# Altium schematic sheet Extension_connectors.SchDoc: Extension_connectors
size A4; Date: Not used; ApprovedBy: Not used; CheckedBy: Not used; Author: Not used; CompanyName: STMicroelectronics; DrawnBy: Not used; Engineer: Not used; Organization: Not used; Address1: Not used; Address2: Not used; Address3: Not used; Address4: Not used; DocumentNumber: Not used; Revision: Not used; SheetNumber: 8; SheetTotal: 12; CurrentTime: Not used; CurrentDate: Not used; Time: Not used; DocumentFullPathAndName: Not used; DocumentName: Not used; ModifiedDate: Not used; ImagePath: Not used; ProjectName: Not used; Application_BuildNumber: Not used
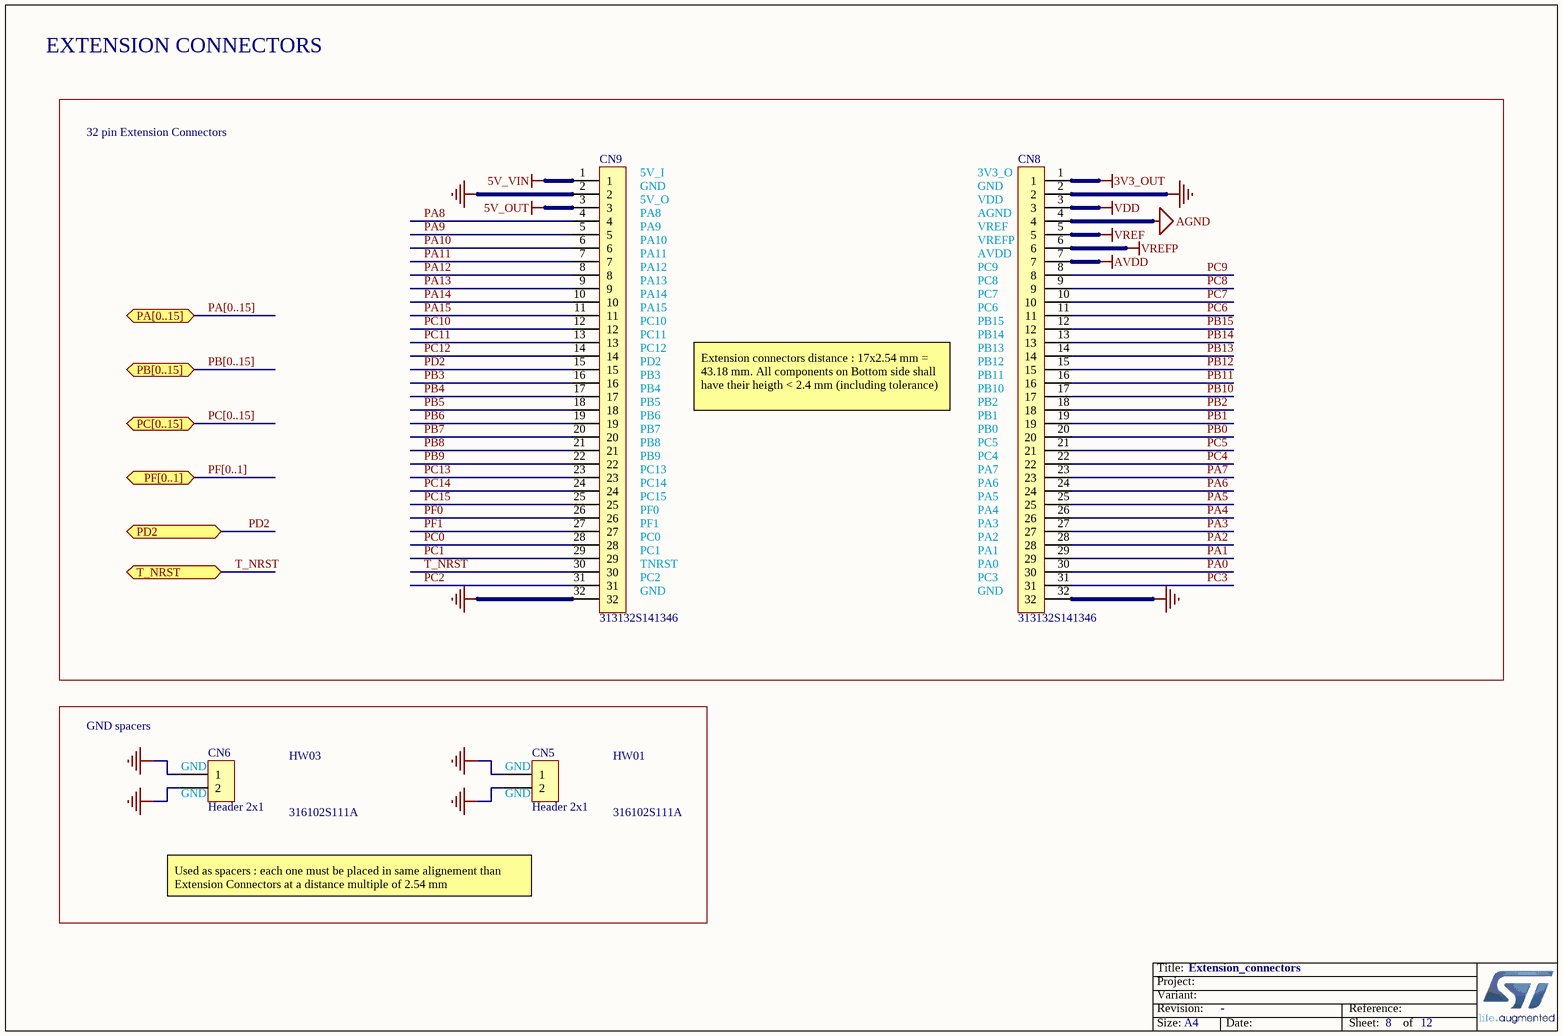
[diagram p0: Extension_connectors.SchDoc]

## Parts
CN5  Header 2x1  [CON_LYCONN_313102S141346]
CN6  Header 2x1  [CON_LYCONN_313102S141346]
CN8  value 313132S141346  [CON_LYCONN_313132S141346]  (hidden comment: Header 32x1)
CN9  value 313132S141346  [CON_LYCONN_313132S141346]  (hidden comment: Header 32x1)
HW01  value 316102S111A  (hidden comment: JUMPER_OPEN)
HW03  value 316102S111A  (hidden comment: JUMPER_OPEN)

## Ports
PA[0..15] (bidir), PB[0..15] (bidir), PC[0..15] (bidir), PD2, PF[0..1] (bidir), T_NRST

## Nets
3V3_OUT: CN8.1
5V_OUT: CN9.3
5V_VIN: CN9.1
AGND: CN8.4
AVDD: CN8.7
GND: CN5.1 CN5.2 CN6.1 CN6.2 CN8.2 CN8.32 CN9.2 CN9.32
VDD: CN8.3
VREF: CN8.5
VREFP: CN8.6
PA0: CN8.30
PA1: CN8.29
PA2: CN8.28
PA3: CN8.27
PA4: CN8.26
PA5: CN8.25
PA6: CN8.24
PA7: CN8.23
PA8: CN9.4
PA9: CN9.5
PA10: CN9.6
PA11: CN9.7
PA12: CN9.8
PA13: CN9.9
PA14: CN9.10
PA15: CN9.11
PB0: CN8.20
PB1: CN8.19
PB2: CN8.18
PB3: CN9.16
PB4: CN9.17
PB5: CN9.18
PB6: CN9.19
PB7: CN9.20
PB8: CN9.21
PB9: CN9.22
PB10: CN8.17
PB11: CN8.16
PB12: CN8.15
PB13: CN8.14
PB14: CN8.13
PB15: CN8.12
PC0: CN9.28
PC1: CN9.29
PC2: CN9.31
PC3: CN8.31
PC4: CN8.22
PC5: CN8.21
PC6: CN8.11
PC7: CN8.10
PC8: CN8.9
PC9: CN8.8
PC10: CN9.12
PC11: CN9.13
PC12: CN9.14
PC13: CN9.23
PC14: CN9.24
PC15: CN9.25
PD2: CN9.15 ; port PD2
PF0: CN9.26
PF1: CN9.27
T_NRST: CN9.30 ; port T_NRST

## Buses and harness runs
bus PA[0..15] = port PA[0..15]
bus PB[0..15] = port PB[0..15]
bus PC[0..15] = port PC[0..15]
bus PF[0..1] = port PF[0..1]

## Notes on the sheet
- EXTENSION CONNECTORS
- 32 pin Extension Connectors
- (near CN9) 5V_I
- (near CN8) 3V3_O
- (near CN9) GND
- (near CN9) 5V_O
- (near CN9) PA8
- (near CN9) PA10
- (near CN9) PA9
- (near CN8) GND
- (near CN8) VDD
- (near CN8) VREF
- (near CN8) AGND
- (near CN8) VREFP
- (near CN9) PA15
- (near CN9) PA14
- (near CN9) PA13
- (near CN9) PA12
- (near CN9) PA11
- (near CN8) AVDD
- (near CN8) PC6
- (near CN8) PC7
- (near CN8) PC8
- (near CN8) PC9
- (near CN9) PB3
- (near CN9) PD2
- (near CN9) PC12
- (near CN9) PC11
- (near CN9) PC10
- (near CN8) PB11
- (near CN8) PB12
- (near CN8) PB13
- (near CN8) PB14
- (near CN8) PB15
- (near CN9) PB7
- (near CN9) PB8
- (near CN9) PB6
- (near CN9) PB5
- (near CN9) PB4
- Extension connectors distance : 17x2.54 mm = 43.18 mm. All components on Bottom side shall have their heigth < 2.4 mm (including tolerance)
- (near CN8) PC5
- (near CN8) PB0
- (near CN8) PB1
- (near CN8) PB2
- (near CN8) PB10
- (near CN9) PF0
- (near CN9) PC15
- (near CN9) PC14
- (near CN9) PC13
- (near CN9) PB9
- (near CN8) PA4
- (near CN8) PA5
- (near CN8) PA6
- (near CN8) PA7
- (near CN8) PC4
- (near CN9) TNRST
- (near CN9) PC2
- (near CN9) PC1
- (near CN9) PC0
- (near CN9) PF1
- (near CN8) PC3
- (near CN8) PA0
- (near CN8) PA1
- (near CN8) PA2
- (near CN8) PA3
- GND spacers
- (near CN6) GND
- (near CN5) GND
- Used as spacers : each one must be placed in same alignement than Extension Connectors at a distance multiple of 2.54 mm
- Title:
- Project:
- Size:
- Revision:
- Variant:
- A4
- -
- Date:
- Reference:
- Sheet:
- of

## Library data of the parts
CN5 CN6 = MCD-01668: Header 2x1, 2.54mm, VR, TH, height 5.84mm/5.08 mm, height total 13.46 mm; Part_Type: Connector; Manufacturer_Part_Number: 313102S141346; Manufacturer: LYCONN; Provided_By: SUBCO; Internal_Part_Number: MCD-01668; Value: Header 2x1; Status: Footprint available; ComponentLink1Description: Datasheet; ComponentLink1URL: http://tunmcdsvn.tun.st.com/Component_Datasheet_Library/Trunk/Connectors/LYCONN_31XXX_2.54mm_L13.46mm/LYCONN_31XXX_2.54mm_L13.46mm.pdf
CN8 CN9 = MCD-01728: 'Header 32x1, 2.54mm, VR, TH, height 5.84mm/5.08 mm, height total 13.46 mm; Part_Type: Connector; Manufacturer: LYCONN; Internal_Part_Number: MCD-01728; Status: Footprint available; Manufacturer_Part_Number: 313132S141346; ComponentLink1Description: Datasheet; ComponentLink1URL: http://tunmcdsvn.tun.st.com/Component_Datasheet_Library/Trunk/Connectors/LYCONN_31XXX_2.54mm_L13.46mm/LYCONN_31XXX_2.54mm_L13.46mm.pdf; Provided_By: n/a
HW01 HW03 = MCD-01849: Jumper, height 6mm, Black, 2.54mm, 3A, 20 mohm, open; Part_Type: Mechanical; Manufacturer: JIUBABA; Provided_By: SUBCO; Internal_Part_Number: MCD-01849; Status: Footprint available; Manufacturer_Part_Number: 316102S111A; ComponentLink1Description: Datasheet; ComponentLink1URL: http://tunmcdsvn.tun.st.com/Component_Datasheet_Library/Trunk/Mechanical/JIUBABA_316102S111A_Jumper_open_2.54mm/JIUBABA_316102S111A_Jumper_open__2.54mm.pdf; ECCN_US: n/a; ECCN_EU: n/a